# Altium schematic sheet SOC_IO.schdoc: =
size A3; Symbol: Sheet-Symbol_A4; Company: 嘉立创EDA; Version: V1.0; Page Size: A4; @Project Name: RK3568B2地瓜派; @Page Count: 27; @Update Date: 2025-09-11; @Create Date: 2025-09-11; @Schematic Name: Schematic1; @Page No: 12; @Page Name: SOC_IO; Device: Sheet-Symbol_A4; Border: 1; Title Block Position: 3; Width: 1655; Height: 1170; Region Start: 1; X Region Count: 6; Y Region Count: 4; Blade Width: 10; @Board Name: Board1; @Create Time: 22:14:45; @Update Time: 22:15:05; Organization: ORGANIZATION; Address1: ADDRESS 1; Address2: ADDRESS 2; Address3: ADDRESS 3; Address4: ADDRESS 4; SheetNumber: 14; SheetTotal: 28
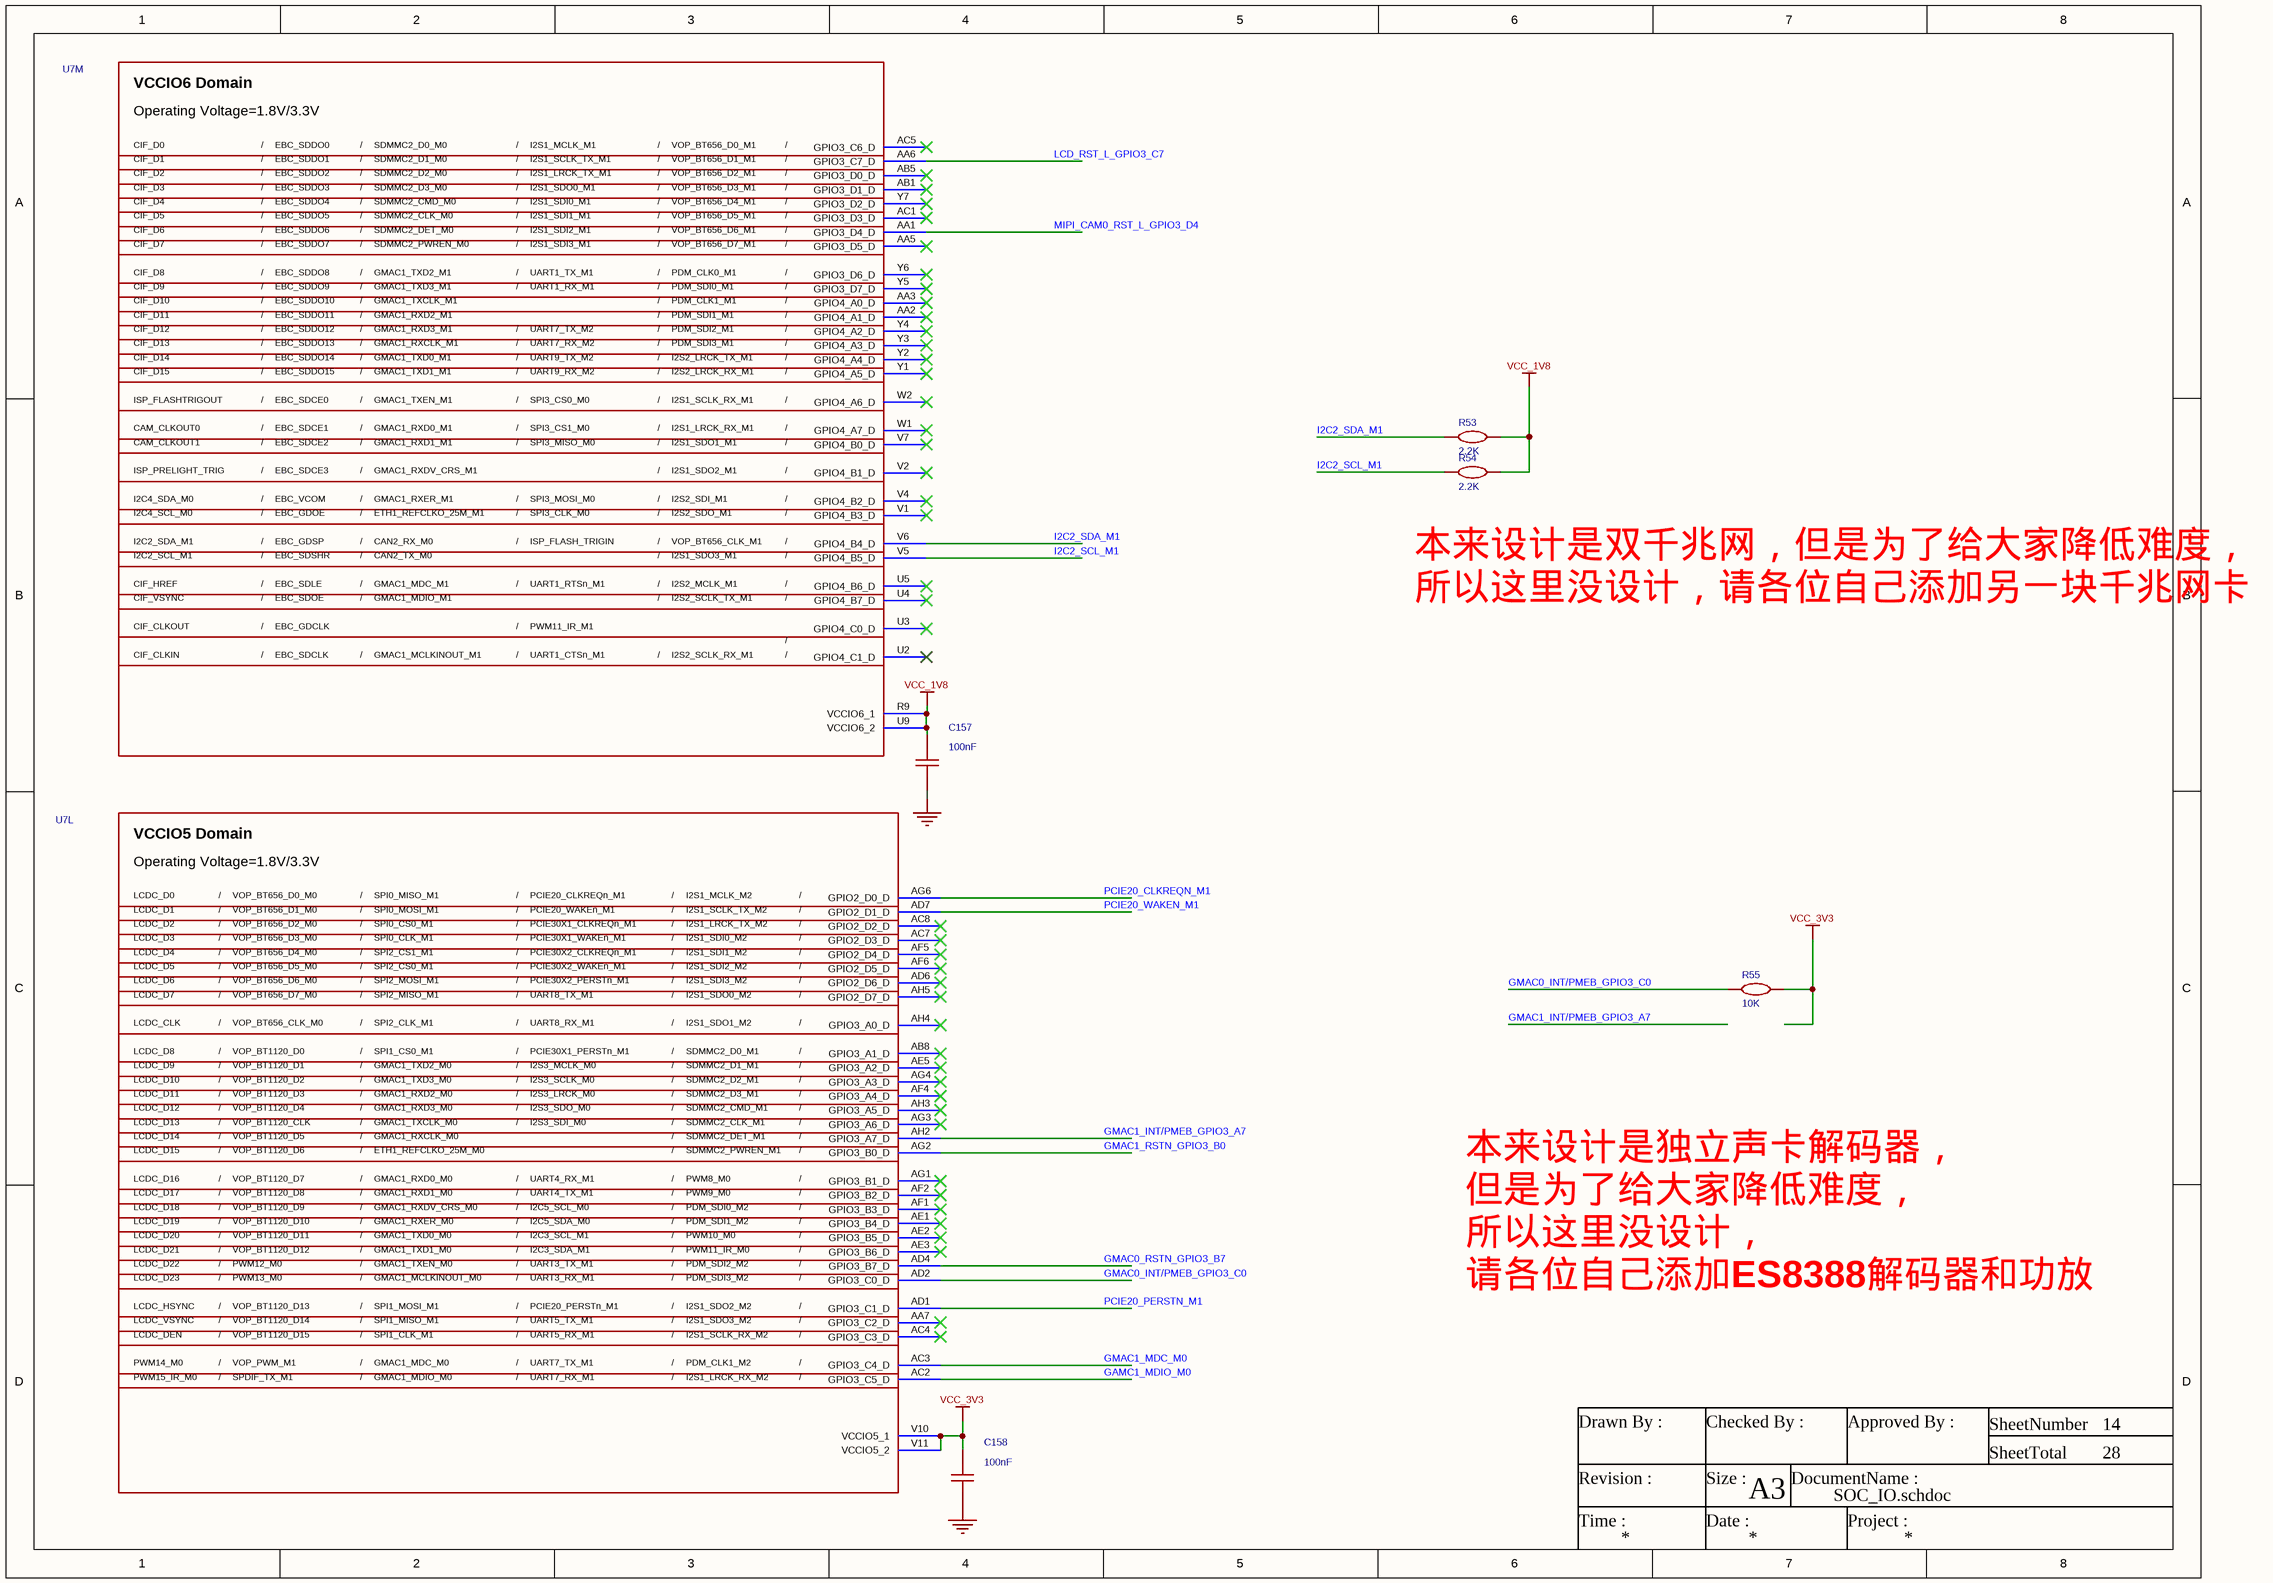
[diagram p0: SOC_IO.schdoc]

## Parts
C157  100nF  [C0201]
C158  100nF  [C0201]
R53  2.2K  [R0402]
R54  2.2K  [R0402]
R55  10K  [R0402]
U7  RK3568  [BGA-636_L19.0-W19.0-P0.65-BL]  (value not drawn)  (parts L,M of 23)

## Nets
GND: C157.1 C158.1
VCC_1V8: C157.2 R53.2 R54.2 U7.R9(VCCIO6_1) U7.U9(VCCIO6_2)
VCC_3V3: C158.2 R55.2 U7.V10(VCCIO5_1) U7.V11(VCCIO5_2)
GAMC1_MDIO_M0: U7.AC2(GPIO3_C5_D)
GMAC0_INT/PMEB_GPIO3_C0: R55.1 U7.AD2(GPIO3_C0_D)
GMAC0_RSTN_GPIO3_B7: U7.AD4(GPIO3_B7_D)
GMAC1_INT/PMEB_GPIO3_A7: U7.AH2(GPIO3_A7_D)
GMAC1_MDC_M0: U7.AC3(GPIO3_C4_D)
GMAC1_RSTN_GPIO3_B0: U7.AG2(GPIO3_B0_D)
I2C2_SCL_M1: R54.1 U7.V5(GPIO4_B5_D)
I2C2_SDA_M1: R53.1 U7.V6(GPIO4_B4_D)
LCD_RST_L_GPIO3_C7: U7.AA6(GPIO3_C7_D)
MIPI_CAM0_RST_L_GPIO3_D4: U7.AA1(GPIO3_D4_D)
PCIE20_CLKREQN_M1: U7.AG6(GPIO2_D0_D)
PCIE20_PERSTN_M1: U7.AD1(GPIO3_C1_D)
PCIE20_WAKEN_M1: U7.AD7(GPIO2_D1_D)

Not connected (* = marked no-connect by the designer): U7 AA2(GPIO4_A1_D)* AA3(GPIO4_A0_D)* AA5(GPIO3_D5_D)* AA7(GPIO3_C2_D)* AB1(GPIO3_D1_D)* AB5(GPIO3_D0_D)* AB8(GPIO3_A1_D)* AC1(GPIO3_D3_D)* AC4(GPIO3_C3_D)* AC5(GPIO3_C6_D)* AC7(GPIO2_D3_D)* AC8(GPIO2_D2_D)* AD6(GPIO2_D6_D)* AE1(GPIO3_B4_D)* AE2(GPIO3_B5_D)* AE3(GPIO3_B6_D)* AE5(GPIO3_A2_D)* AF1(GPIO3_B3_D)* AF2(GPIO3_B2_D)* AF4(GPIO3_A4_D)* AF5(GPIO2_D4_D)* AF6(GPIO2_D5_D)* AG1(GPIO3_B1_D)* AG3(GPIO3_A6_D)* AG4(GPIO3_A3_D)* AH3(GPIO3_A5_D)* AH4(GPIO3_A0_D)* AH5(GPIO2_D7_D)* U2(GPIO4_C1_D)* U3(GPIO4_C0_D)* U4(GPIO4_B7_D)* U5(GPIO4_B6_D)* V1(GPIO4_B3_D)* V2(GPIO4_B1_D)* V4(GPIO4_B2_D)* V7(GPIO4_B0_D)* W1(GPIO4_A7_D)* W2(GPIO4_A6_D)* Y1(GPIO4_A5_D)* Y2(GPIO4_A4_D)* Y3(GPIO4_A3_D)* Y4(GPIO4_A2_D)* Y5(GPIO3_D7_D)* Y6(GPIO3_D6_D)* Y7(GPIO3_D2_D)*

## Notes on the sheet
- 本来设计是双千兆网，但是为了给大家降低难度，
  所以这里没设计，请各位自己添加另一块千兆网卡
- 本来设计是独立声卡解码器，
  但是为了给大家降低难度，
  所以这里没设计，
  请各位自己添加ES8388解码器和功放
- Drawn By :
- Checked By :
- Approved By :
- SheetNumber
- SheetTotal
- Revision :
- Time :
- Size :
- Date :
- A3
- DocumentName :
- Project :
- (in symbol RK3568, part L) VCCIO5 Domain; Operating Voltage=1.8V/3.3V; LCDC_D0; /; VOP_BT656_D0_M0; SPI0_MISO_M1; PCIE20_CLKREQn_M1; I2S1_MCLK_M2; LCDC_D1; VOP_BT656_D1_M0; SPI0_MOSI_M1; PCIE20_WAKEn_M1; I2S1_SCLK_TX_M2; LCDC_D2; VOP_BT656_D2_M0; SPI0_CS0_M1; PCIE30X1_CLKREQn_M1; I2S1_LRCK_TX_M2; LCDC_D3; VOP_BT656_D3_M0; SPI0_CLK_M1; PCIE30X1_WAKEn_M1; I2S1_SDI0_M2; LCDC_D4; VOP_BT656_D4_M0; SPI2_CS1_M1; PCIE30X2_CLKREQn_M1; I2S1_SDI1_M2; LCDC_D5; VOP_BT656_D5_M0; SPI2_CS0_M1; PCIE30X2_WAKEn_M1; I2S1_SDI2_M2; LCDC_D6; VOP_BT656_D6_M0; SPI2_MOSI_M1; PCIE30X2_PERSTn_M1; I2S1_SDI3_M2; LCDC_D7; VOP_BT656_D7_M0; SPI2_MISO_M1; UART8_TX_M1; I2S1_SDO0_M2; LCDC_CLK; VOP_BT656_CLK_M0; SPI2_CLK_M1; UART8_RX_M1; I2S1_SDO1_M2; LCDC_D8; VOP_BT1120_D0; SPI1_CS0_M1; PCIE30X1_PERSTn_M1; SDMMC2_D0_M1; LCDC_D9; VOP_BT1120_D1; GMAC1_TXD2_M0; I2S3_MCLK_M0; SDMMC2_D1_M1; LCDC_D10; VOP_BT1120_D2; GMAC1_TXD3_M0; I2S3_SCLK_M0; SDMMC2_D2_M1; LCDC_D11; VOP_BT1120_D3; GMAC1_RXD2_M0; I2S3_LRCK_M0; SDMMC2_D3_M1; LCDC_D12; VOP_BT1120_D4; GMAC1_RXD3_M0; I2S3_SDO_M0; SDMMC2_CMD_M1; LCDC_D13; VOP_BT1120_CLK; GMAC1_TXCLK_M0; I2S3_SDI_M0; SDMMC2_CLK_M1; LCDC_D14; VOP_BT1120_D5; GMAC1_RXCLK_M0; SDMMC2_DET_M1; LCDC_D15; VOP_BT1120_D6; ETH1_REFCLKO_25M_M0; SDMMC2_PWREN_M1; LCDC_D16; VOP_BT1120_D7; GMAC1_RXD0_M0; UART4_RX_M1; PWM8_M0; LCDC_D17; VOP_BT1120_D8; GMAC1_RXD1_M0; UART4_TX_M1; PWM9_M0; LCDC_D18; VOP_BT1120_D9; GMAC1_RXDV_CRS_M0; I2C5_SCL_M0; PDM_SDI0_M2; LCDC_D19; VOP_BT1120_D10; GMAC1_RXER_M0; I2C5_SDA_M0; PDM_SDI1_M2; LCDC_D20; VOP_BT1120_D11; GMAC1_TXD0_M0; I2C3_SCL_M1; PWM10_M0; LCDC_D21; VOP_BT1120_D12; GMAC1_TXD1_M0; I2C3_SDA_M1; PWM11_IR_M0; LCDC_D22; PWM12_M0; GMAC1_TXEN_M0; UART3_TX_M1; PDM_SDI2_M2; LCDC_D23; PWM13_M0; GMAC1_MCLKINOUT_M0; UART3_RX_M1; PDM_SDI3_M2; LCDC_HSYNC; VOP_BT1120_D13; SPI1_MOSI_M1; PCIE20_PERSTn_M1; I2S1_SDO2_M2; LCDC_VSYNC; VOP_BT1120_D14; SPI1_MISO_M1; UART5_TX_M1; I2S1_SDO3_M2; LCDC_DEN; VOP_BT1120_D15; SPI1_CLK_M1; UART5_RX_M1; I2S1_SCLK_RX_M2; PWM14_M0; VOP_PWM_M1; GMAC1_MDC_M0; UART7_TX_M1; PDM_CLK1_M2; PWM15_IR_M0; SPDIF_TX_M1; GMAC1_MDIO_M0; UART7_RX_M1; I2S1_LRCK_RX_M2
- (in symbol RK3568, part M) VCCIO6 Domain; Operating Voltage=1.8V/3.3V; CIF_D0; /; EBC_SDDO0; SDMMC2_D0_M0; I2S1_MCLK_M1; VOP_BT656_D0_M1; CIF_D1; EBC_SDDO1; SDMMC2_D1_M0; I2S1_SCLK_TX_M1; VOP_BT656_D1_M1; CIF_D2; EBC_SDDO2; SDMMC2_D2_M0; I2S1_LRCK_TX_M1; VOP_BT656_D2_M1; CIF_D3; EBC_SDDO3; SDMMC2_D3_M0; I2S1_SDO0_M1; VOP_BT656_D3_M1; CIF_D4; EBC_SDDO4; SDMMC2_CMD_M0; I2S1_SDI0_M1; VOP_BT656_D4_M1; CIF_D5; EBC_SDDO5; SDMMC2_CLK_M0; I2S1_SDI1_M1; VOP_BT656_D5_M1; CIF_D6; EBC_SDDO6; SDMMC2_DET_M0; I2S1_SDI2_M1; VOP_BT656_D6_M1; CIF_D7; EBC_SDDO7; SDMMC2_PWREN_M0; I2S1_SDI3_M1; VOP_BT656_D7_M1; CIF_D8; EBC_SDDO8; GMAC1_TXD2_M1; UART1_TX_M1; PDM_CLK0_M1; CIF_D9; EBC_SDDO9; GMAC1_TXD3_M1; UART1_RX_M1; PDM_SDI0_M1; CIF_D10; EBC_SDDO10; GMAC1_TXCLK_M1; PDM_CLK1_M1; CIF_D11; EBC_SDDO11; GMAC1_RXD2_M1; PDM_SDI1_M1; CIF_D12; EBC_SDDO12; GMAC1_RXD3_M1; UART7_TX_M2; PDM_SDI2_M1; CIF_D13; EBC_SDDO13; GMAC1_RXCLK_M1; UART7_RX_M2; PDM_SDI3_M1; CIF_D14; EBC_SDDO14; GMAC1_TXD0_M1; UART9_TX_M2; I2S2_LRCK_TX_M1; CIF_D15; EBC_SDDO15; GMAC1_TXD1_M1; UART9_RX_M2; I2S2_LRCK_RX_M1; ISP_FLASHTRIGOUT; EBC_SDCE0; GMAC1_TXEN_M1; SPI3_CS0_M0; I2S1_SCLK_RX_M1; CAM_CLKOUT0; EBC_SDCE1; GMAC1_RXD0_M1; SPI3_CS1_M0; I2S1_LRCK_RX_M1; CAM_CLKOUT1; EBC_SDCE2; GMAC1_RXD1_M1; SPI3_MISO_M0; I2S1_SDO1_M1; ISP_PRELIGHT_TRIG; EBC_SDCE3; GMAC1_RXDV_CRS_M1; I2S1_SDO2_M1; I2C4_SDA_M0; EBC_VCOM; GMAC1_RXER_M1; SPI3_MOSI_M0; I2S2_SDI_M1; I2C4_SCL_M0; EBC_GDOE; ETH1_REFCLKO_25M_M1; SPI3_CLK_M0; I2S2_SDO_M1; I2C2_SDA_M1; EBC_GDSP; CAN2_RX_M0; ISP_FLASH_TRIGIN; VOP_BT656_CLK_M1; I2C2_SCL_M1; EBC_SDSHR; CAN2_TX_M0; I2S1_SDO3_M1; CIF_HREF; EBC_SDLE; GMAC1_MDC_M1; UART1_RTSn_M1; I2S2_MCLK_M1; CIF_VSYNC; EBC_SDOE; GMAC1_MDIO_M1; I2S2_SCLK_TX_M1; CIF_CLKOUT; EBC_GDCLK; PWM11_IR_M1; CIF_CLKIN; EBC_SDCLK; GMAC1_MCLKINOUT_M1; UART1_CTSn_M1; I2S2_SCLK_RX_M1

## Library data of the parts
C157 C158 = GRM035R60J475ME15D: 容值:4.7uF;精度:±20%;额定电压:6.3V;温度系数:X5R;; Manufacturer: muRata(村田); AddInBom: yes; ModelId: e8033a7cb35143ffb28e3b81b2577ea0; ModelName: C0201_L0.6-W0.3-H0.3; ModelTransform: 23.622,11.811,0,0,0,0,0,0,0; Tolerance: ±20%; Voltage Rating: 6.3V; Temperature Coefficient: X5R; Symbol: GRM035R60J475ME15D; Value: 100nF; Device: GRM035R60J475ME15D; LCSC Part Name: 4.7uF ±20% 6.3V; ManufacturerPart: GRM035R60J475ME15D; Supplier Footprint: 0201; JLCPCB Part Class: Extended Part; Datasheet: https://item.szlcsc.com/datasheet/GRM035R60J475ME15D/313624.html; Supplier: LCSC; ConvertToPcb: yes; FootprintName: C0201
R53-R55 = Res_0402: Symbol: 电阻; ConvertToPcb: yes; ModelId: 671aefced39d4c318694bba8bd8efd39; ModelName: R0402_L1.0-W0.5-H0.5; ModelTransform: 39.37,19.685,0,0,0,0,0,0.0005,0; Device: Res_0402; AddInBom: yes; Supplier Footprint: 0402; FootprintName: R0402
  R53 R54: Value: 2.2K
  R55: Value: 10K
U7 = RK3568: ConvertToPcb: yes; ModelId: e6756cba1b9f43448429fdcd1d44d9d9; ModelTransform: 748.03,748.03,54.33,0,0,0,0,0,0; Symbol: RK3568; Device: RK3568; AddInBom: yes; FootprintName: BGA-636_L19.0-W19.0-P0.65-BL; ModelName: BGA-636_L19.0-W19.0-P0.65-BL